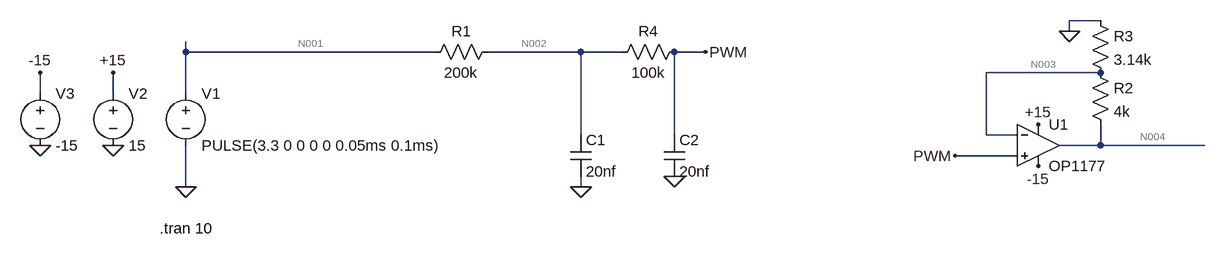
[diagram p0: schematic Draft1.asc]
Draft1.asc, the LTspice schematic file:
Version 4
SHEET 1 1620 680
WIRE 1456 32 1408 32
WIRE 1408 48 1408 32
WIRE 48 80 48 64
WIRE 432 80 48 80
WIRE 656 80 512 80
WIRE 720 80 656 80
WIRE 848 80 800 80
WIRE 1456 112 1280 112
WIRE -176 144 -176 112
WIRE -64 144 -64 112
WIRE 48 144 48 80
WIRE 656 208 656 80
WIRE 800 208 800 80
WIRE 1280 208 1280 112
WIRE 1328 208 1280 208
WIRE 1456 224 1456 192
WIRE 1456 224 1392 224
WIRE 1616 224 1456 224
WIRE 1328 240 1232 240
WIRE 48 288 48 224
WIRE 656 288 656 272
FLAG 48 288 0
FLAG 656 288 0
FLAG 848 80 PWM
FLAG -64 112 +15
FLAG 1360 192 +15
FLAG -176 112 -15
FLAG 1360 256 -15
FLAG -176 224 0
FLAG -64 224 0
FLAG 1232 240 PWM
FLAG 1408 48 0
FLAG 800 272 0
SYMBOL voltage 48 128 R0
WINDOW 123 0 0 Left 2
WINDOW 39 0 0 Left 2
SYMATTR InstName V1
SYMATTR Value PULSE(3.3 0 0 0 0 0.05ms 0.1ms)
SYMBOL res 528 64 R90
WINDOW 0 0 56 VBottom 2
WINDOW 3 32 56 VTop 2
SYMATTR InstName R1
SYMATTR Value 200k
SYMBOL cap 640 208 R0
SYMATTR InstName C1
SYMATTR Value 20nf
SYMBOL AutoGenerated\\OP1177 1360 160 R0
SYMATTR InstName U1
SYMBOL voltage -64 128 R0
WINDOW 123 0 0 Left 2
WINDOW 39 0 0 Left 2
SYMATTR InstName V2
SYMATTR Value 15
SYMBOL voltage -176 128 R0
WINDOW 123 0 0 Left 2
WINDOW 39 0 0 Left 2
SYMATTR InstName V3
SYMATTR Value -15
SYMBOL res 1440 96 R0
SYMATTR InstName R2
SYMATTR Value 4k
SYMBOL res 1440 16 R0
SYMATTR InstName R3
SYMATTR Value 3.14k
SYMBOL res 816 64 R90
WINDOW 0 0 56 VBottom 2
WINDOW 3 32 56 VTop 2
SYMATTR InstName R4
SYMATTR Value 100k
SYMBOL cap 784 208 R0
SYMATTR InstName C2
SYMATTR Value 20nf
TEXT 8 352 Left 2 !.tran 10

The netlist it stands for:
* Draft1.asc
V1 N001 0 PULSE(3.3 0 0 0 0 0.05ms 0.1ms)
R1 N002 N001 200k
C1 N002 0 20nf
XU1 PWM N003 +15 -15 N004 OP1177  ; pins In+ In- V+ V- OUT
V2 +15 0 15
V3 -15 0 -15
R2 N003 N004 4k
R3 0 N003 3.14k
R4 PWM N002 100k
C2 PWM 0 20nf
.tran 10
.lib ADI1.lib
.backanno
.end

* Results of the author's LTspice run, read from the files saved beside the schematic
* Operating Point, zero values left out:
*   V(n001) = 3.3 V
*   V(n002) = 3.3 V
*   V(pwm) = 3.3 V
*   V(n003) = 3.3 V
*   V(+15) = 15 V
*   V(-15) = -15 V
*   V(n004) = 7.504 V
*   I(R4) = 384.1 pA
*   I(R3) = -1.051 mA
*   I(R2) = -1.051 mA
*   I(R1) = 384.1 pA
*   I(V3) = 400 µA
*   I(V2) = -1.451 mA
*   I(V1) = 384.1 pA
*   Ix(u1:1) = -384.1 pA
*   Ix(u1:2) = -584.2 pA
*   Ix(u1:99) = 1.451 mA
*   Ix(u1:50) = -400 µA
*   Ix(u1:34) = -1.051 mA